# Altium schematic sheet STM32F429_MAIN.SchDoc
size A1; SheetNumber: 1; SheetTotal: 1
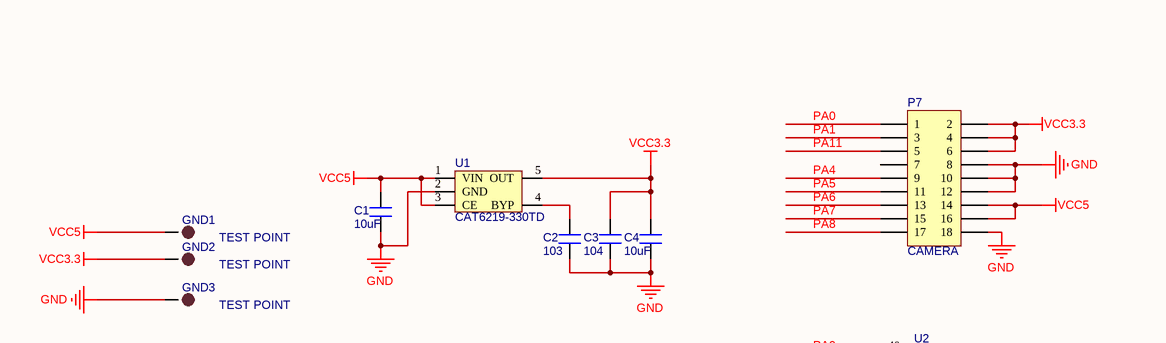
[diagram p0: STM32F429_MAIN.SchDoc, top left]
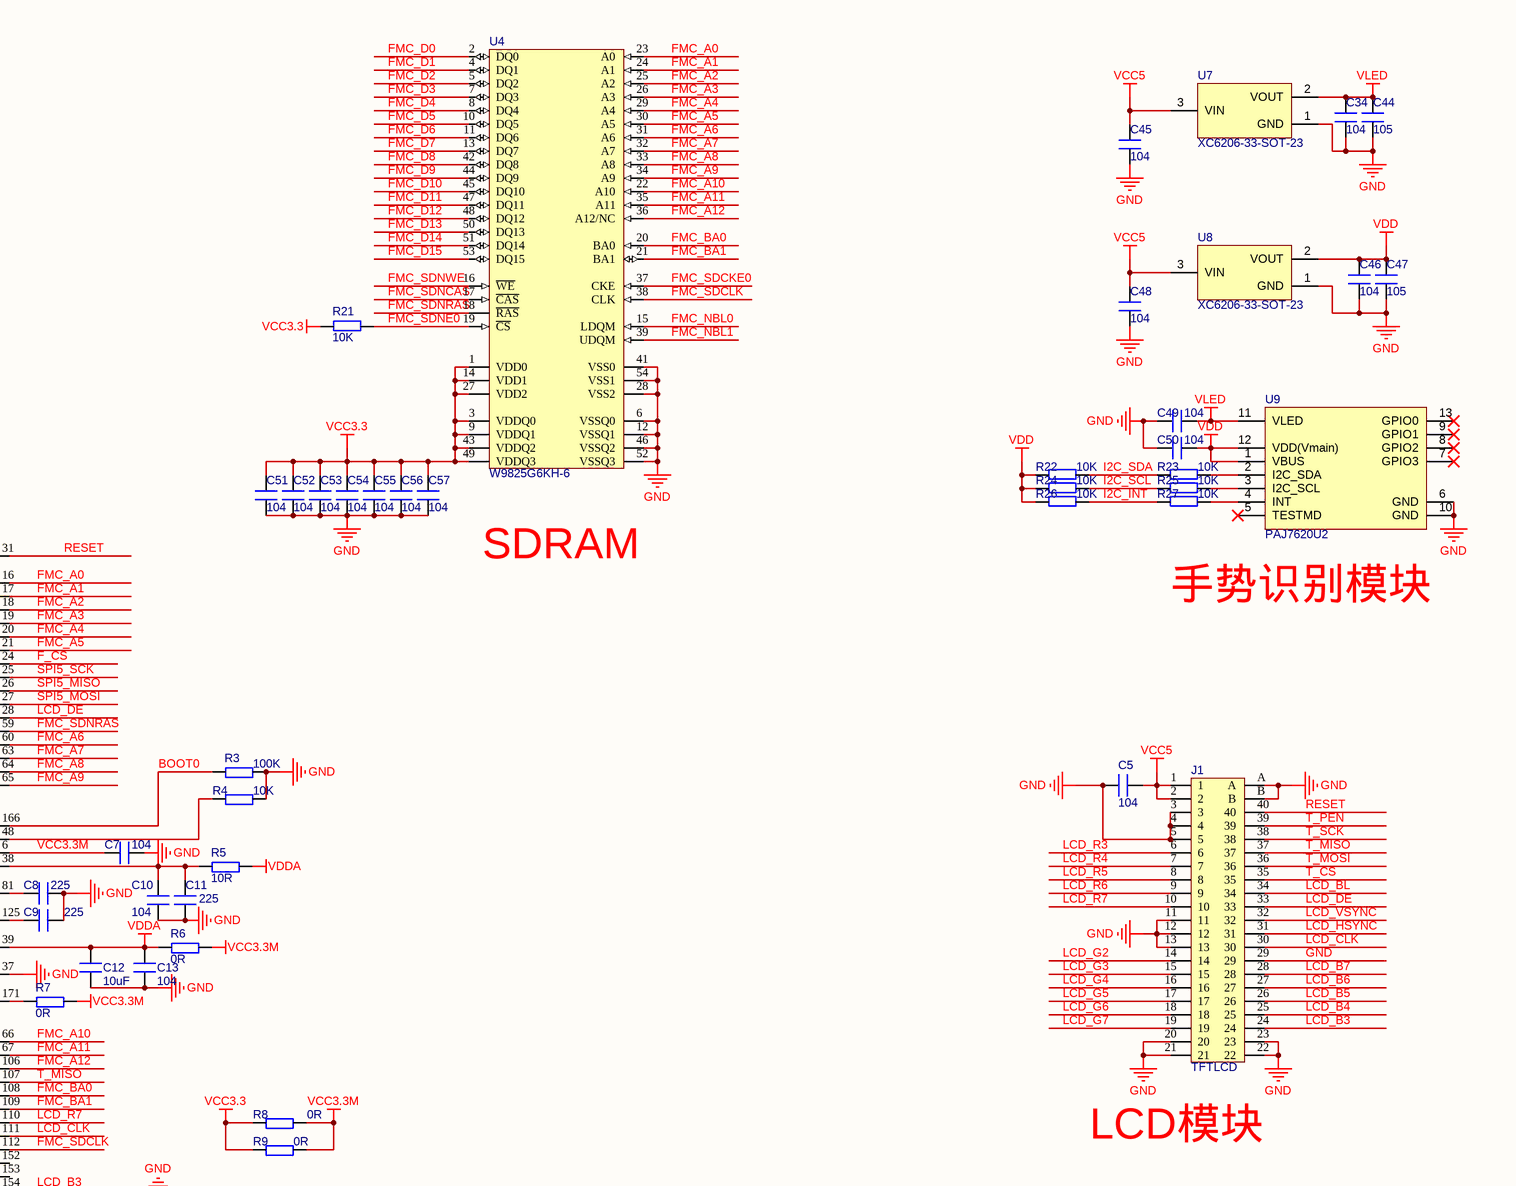
[diagram p1: STM32F429_MAIN.SchDoc, top right]
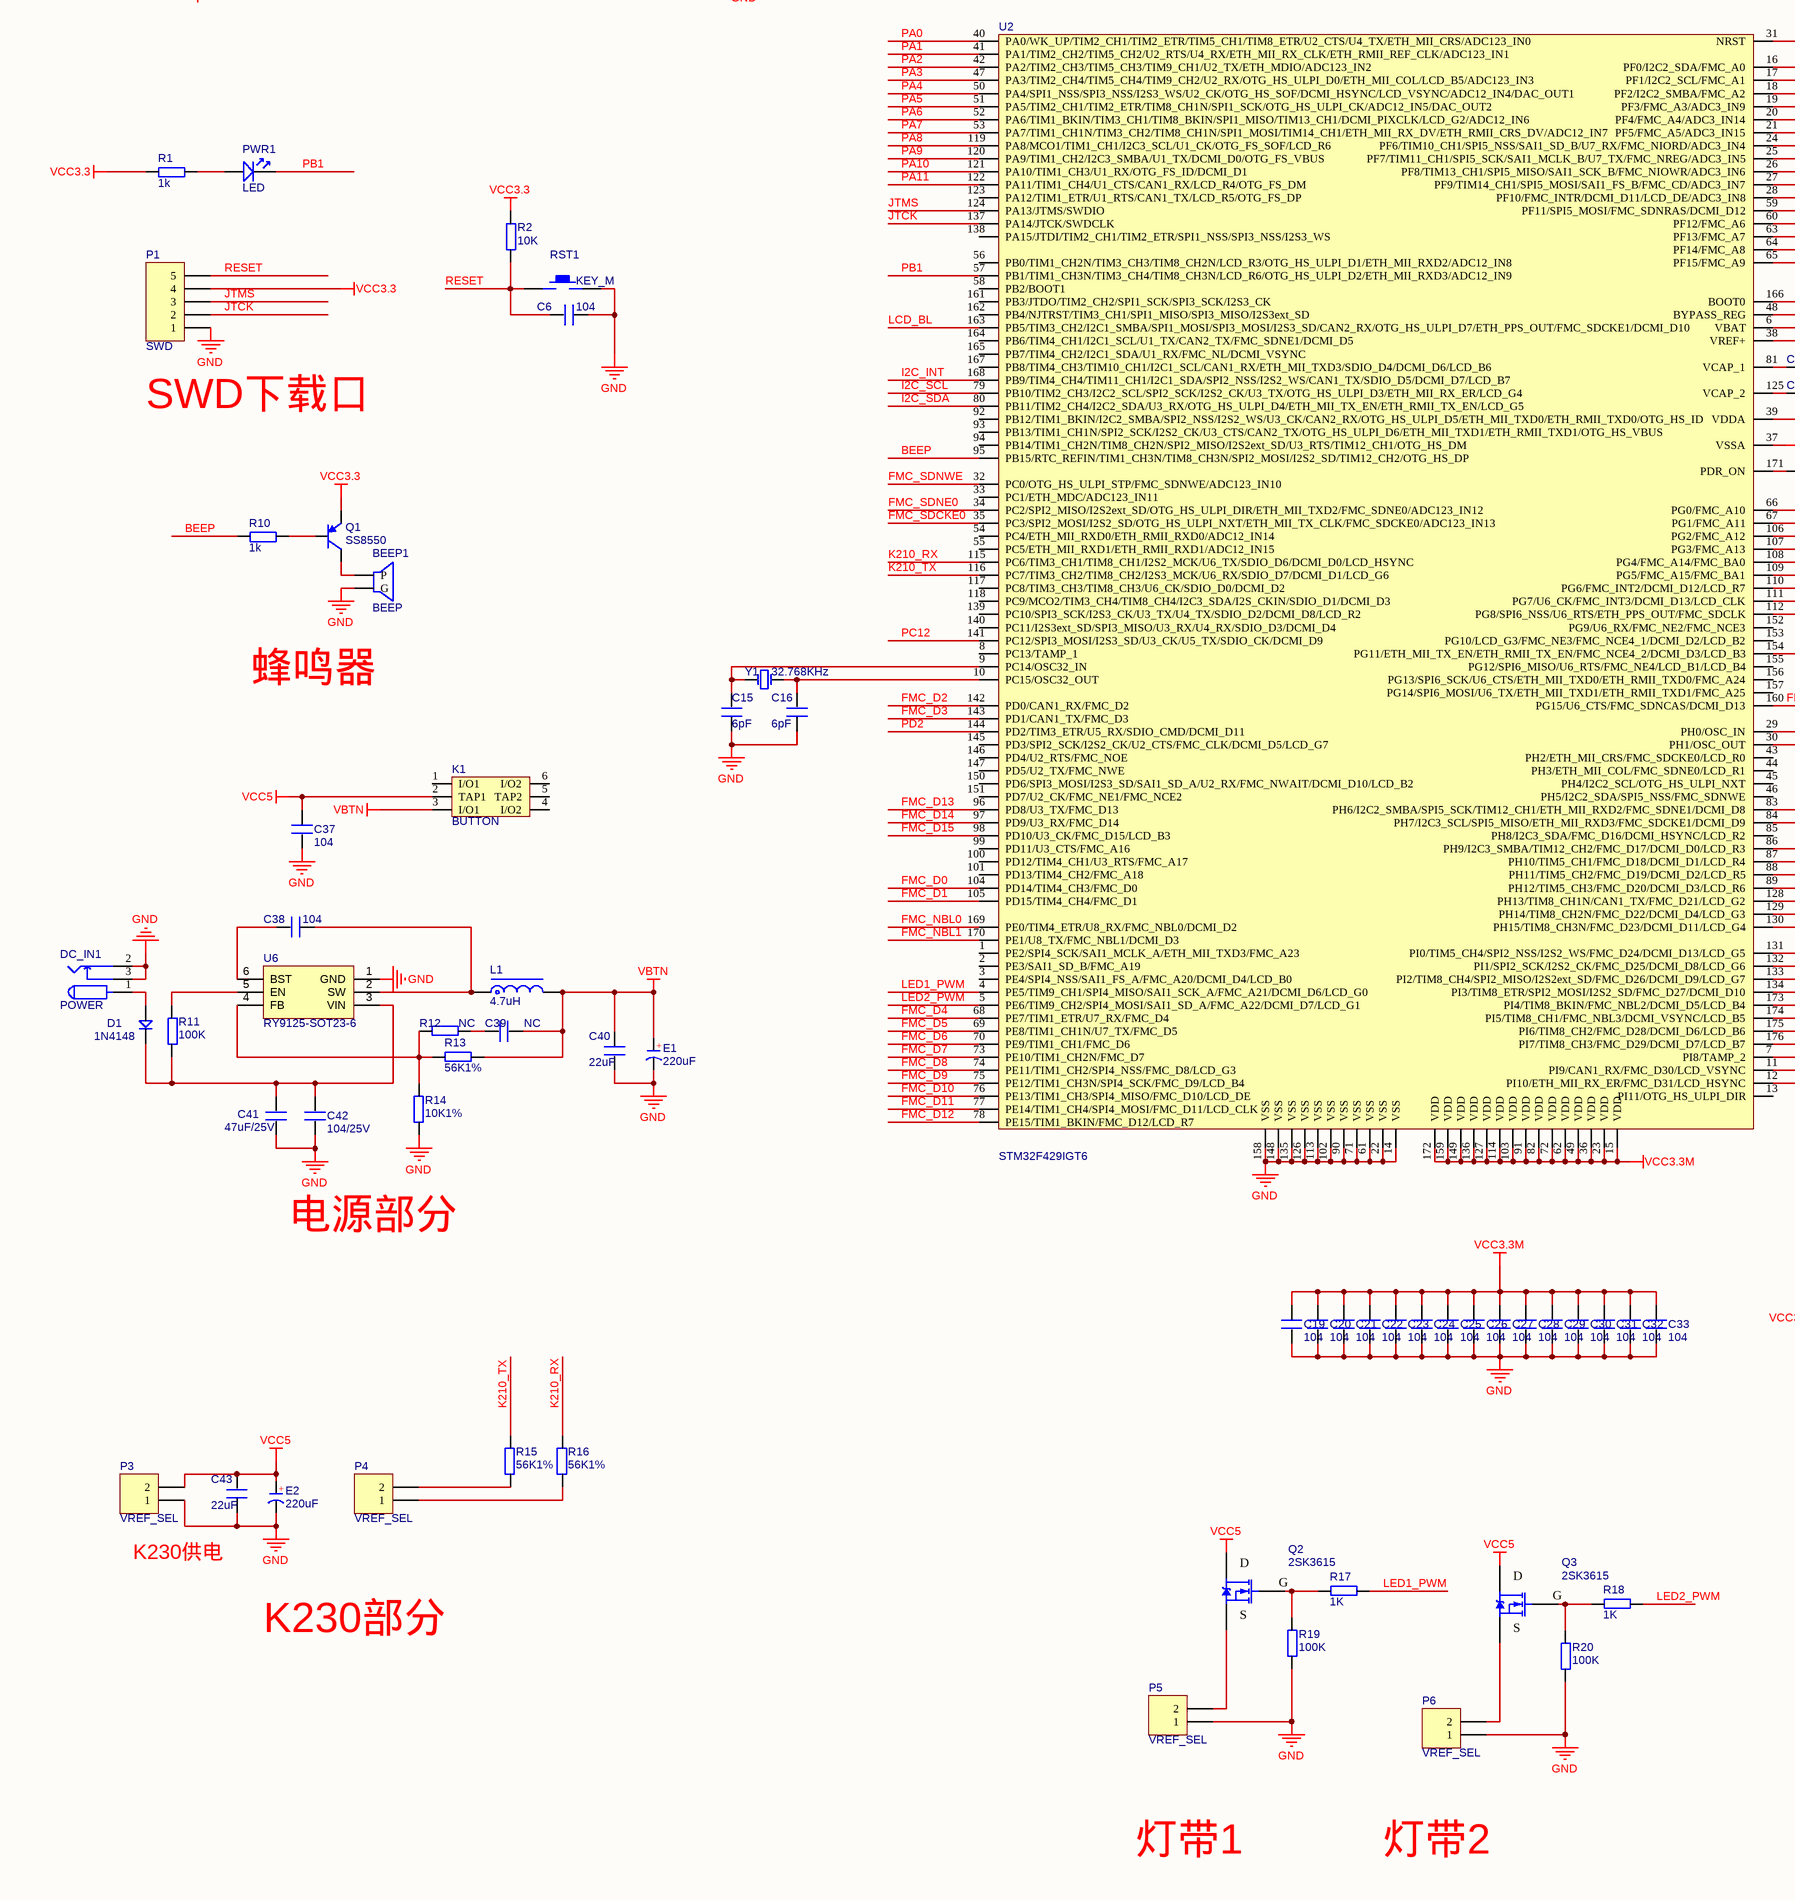
[diagram p2: STM32F429_MAIN.SchDoc, bottom left]
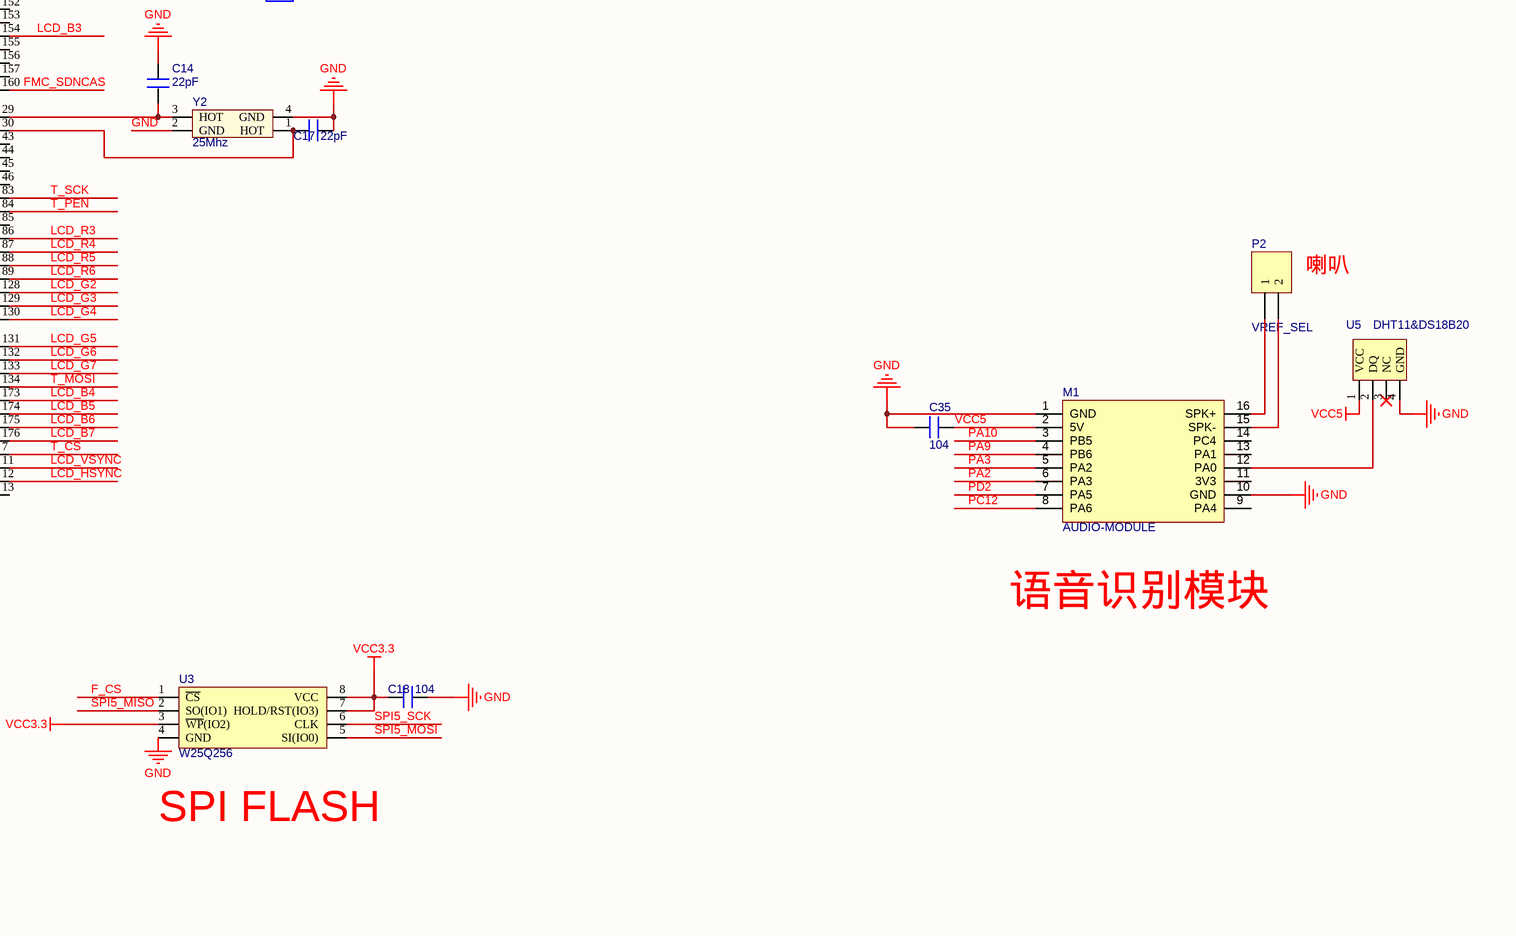
[diagram p3: STM32F429_MAIN.SchDoc, bottom right]

## Parts
BEEP1  BEEP  [BELL-5]
C1  10uF  [0402]
C2  103  [0402]
C3  104  [0402]
C4  10uF  [0402]
C5  104  [0603P]
C6  104  [0402]
C7  104  [0402]
C8  225  [0402]
C9  225  [0402]
C10  104  [0402]
C11  225  [0402]
C12  10uF  [0402]
C13  104  [0402]
C14  22pF  [0402]
C15  6pF  [0402]
C16  6pF  [0402]
C17  22pF  [0402]
C18  104  [0402]
C19  104  [0402]
C20  104  [0402]
C21  104  [0402]
C22  104  [0402]
C23  104  [0402]
C24  104  [0402]
C25  104  [0402]
C26  104  [0402]
C27  104  [0402]
C28  104  [0402]
C29  104  [0402]
C30  104  [0402]
C31  104  [0402]
C32  104  [0402]
C33  104  [0402]
C34  104  [0603P]
C35  104  [0603P]
C37  104  [0402]
C38  104  [0805]
C39  NC  [0603P]
C40  22uF  [C 1206_L]
C41  47uF/25V  [0805]
C42  104/25V  [0805]
C43  22uF  [0402]
C44  105  [0603P]
C45  104  [0603P]
C46  104  [0603P]
C47  105  [0603P]
C48  104  [0603P]
C49  104  [0603P]
C50  104  [0603P]
C51  104  [0603P]
C52  104  [0603P]
C53  104  [0603P]
C54  104  [0603P]
C55  104  [0603P]
C56  104  [0603P]
C57  104  [0603P]
D1  1N4148  [DIODE_SOP]
DC_IN1  POWER  [DC10B]
E1  220uF  [CM A(3*5.4)]
E2  220uF  [CM A(3*5.4)]
GND1  TEST POINT  [TP-1.5]
GND2  TEST POINT  [TP-1.5]
GND3  TEST POINT  [TP-1.5]
J1  TFTLCD  [FPC-TOP40]
K1  BUTTON  [BTN8.5*8.5]
L1  4.7uH  [CD31]
M1  AUDIO-MODULE  [AI_audio]
P1  SWD  [HDR1X5]
P2  VREF_SEL  [HDR1X2]
P3  VREF_SEL  [HDR1X2]
P4  VREF_SEL  [HDR1X2]
P5  VREF_SEL  [HDR1X2]
P6  VREF_SEL  [HDR1X2]
P7  CAMERA  [HDR2X9]
PWR1  LED  [SMDLED-0603]
Q1  SS8550  [SOT23-3N]
Q2  2SK3615  [TO252]
Q3  2SK3615  [TO252]
R1  1k  [0402]
R2  10K  [0402]
R3  100K  [0402]
R4  10K  [0402]
R5  10R  [0402]
R6  0R  [0402]
R7  0R  [0402]
R8  0R  [0402]
R9  0R  [0402]
R10  1k  [0402]
R11  100K  [0603P]
R12  NC  [0603P]
R13  56K1%  [0603P]
R14  10K1%  [0603P]
R15  56K1%  [0402]
R16  56K1%  [0402]
R17  1K  [0603P]
R18  1K  [0603P]
R19  100K  [0603P]
R20  100K  [0603P]
R21  10K  [0402]
R22  10K  [0402]
R23  10K  [0402]
R24  10K  [0402]
R25  10K  [0402]
R26  10K  [0402]
R27  10K  [0402]
RST1  KEY_M  [KEY_SOP3625]
U1  CAT6219-330TD  [SOT-23-5]
U2  STM32F429IGT6  [LQFP176]
U3  W25Q256  [WSON8]
U4  W9825G6KH-6  [TSOP54]
U5  DHT11&DS18B20  [DHT11]
U6  RY9125-SOT23-6  [SOT23-6]
U7  XC6206-33-SOT-23  [SOT-23]
U8  XC6206-33-SOT-23  [SOT-23]
U9  PAJ7620U2  [PAJ7620U2]
Y1  32.768KHz  [XTAL3215]
Y2  25Mhz  [XTAL3225]

## Nets
GND: BEEP1.2(G) C1.1 C2.1 C3.1 C4.1 C5.1 C6.1 C7.1 C8.1 C9.1 C10.1 C11.2 C12.1 C13.1 C14.2 C15.1 C16.1 C17.2 C18.1 C19.2 C20.2 C21.2 C22.2 C23.2 C24.2 C25.2 C26.2 C27.2 C28.2 C29.2 C30.2 C31.2 C32.2 C33.2 C34.1 C35.2 C37.1 C40.2 C41.2 C42.2 C43.2 C44.1 C45.1 C46.1 C47.1 C48.1 C49.1 C50.1 C51.1 C52.1 C53.1 C54.1 C55.1 C56.1 C57.1 DC_IN1.2 DC_IN1.3 E1.2(K) E2.2(K) GND3.1 J1.3 J1.4 J1.5 J1.11 J1.12 J1.13 J1.20 J1.21 J1.22 J1.23 J1.29 J1.A J1.B M1.1(GND) M1.10(GND) P1.1 P3.1 P5.1 P6.1 P7.8 P7.10 P7.12 P7.18 R3.2 R4.2 R14.2 R19.1 R20.1 RST1.2 U1.2(GND) U2.14(VSS) U2.22(VSS) U2.37(VSSA) U2.61(VSS) U2.71(VSS) U2.90(VSS) U2.102(VSS) U2.113(VSS) U2.126(VSS) U2.135(VSS) U2.148(VSS) U2.158(VSS) U3.4(GND) U4.6(VSSQ0) U4.12(VSSQ1) U4.28(VSS2) U4.41(VSS0) U4.46(VSSQ2) U4.52(VSSQ3) U4.54(VSS1) U5.4(GND) U6.1(GND) U7.1(GND) U8.1(GND) U9.6(GND) U9.10(GND) Y2.2(GND) Y2.4(GND)
VBTN: C39.1 C40.1 E1.1(A) K1.3(I/O1) L1.2 R13.1
VCC3.3: C3.2 C4.2 C18.2 C51.2 C52.2 C53.2 C54.2 C55.2 C56.2 C57.2 GND2.1 P1.4 P7.2 P7.4 P7.6 Q1.2(E) R1.1 R2.2 R8.1 R9.1 R21.2 U1.5(OUT) U3.3(~{WP}(IO2)) U3.7(HOLD/RST(IO3)) U3.8(VCC) U4.1(VDD0) U4.3(VDDQ0) U4.9(VDDQ1) U4.14(VDD1) U4.27(VDD2) U4.43(VDDQ2) U4.49(VDDQ3)
VCC3.3M: C7.2 C19.1 C20.1 C21.1 C22.1 C23.1 C24.1 C25.1 C26.1 C27.1 C28.1 C29.1 C30.1 C31.1 C32.1 C33.1 R6.2 R7.2 R8.2 R9.2 U2.6(VBAT) U2.15(VDD) U2.23(VDD) U2.36(VDD) U2.49(VDD) U2.62(VDD) U2.72(VDD) U2.82(VDD) U2.91(VDD) U2.103(VDD) U2.114(VDD) U2.127(VDD) U2.136(VDD) U2.149(VDD) U2.159(VDD) U2.172(VDD)
VCC5: C1.2 C5.2 C35.1 C37.2 C43.1 C45.2 C48.2 E2.1(A) GND1.1 J1.1 J1.2 K1.2(TAP1) M1.2(5V) P3.2 P7.14 P7.16 Q2.2(D) Q3.2(D) U1.1(VIN) U1.3(CE) U5.1(VCC) U7.3(VIN) U8.3(VIN)
VDD: C46.2 C47.2 C50.2 R22.2 R24.2 R26.2 U8.2(VOUT) U9.1(VBUS) U9.12(VDD(Vmain))
VDDA: C12.2 C13.2 R5.2 R6.1 U2.39(VDDA)
VLED: C34.2 C44.2 C49.2 U7.2(VOUT) U9.11(VLED)
BEEP: R10.1 U2.95(PB15/RTC_REFIN/TIM1_CH3N/TIM8_CH3N/SPI2_MOSI/I2S2_SD/TIM12_CH2/OTG_HS_DP)
BOOT0: R3.1 U2.166(BOOT0)
F_CS: U2.24(PF6/TIM10_CH1/SPI5_NSS/SAI1_SD_B/U7_RX/FMC_NIORD/ADC3_IN4) U3.1(~{CS})
FMC_A0: U2.16(PF0/I2C2_SDA/FMC_A0) U4.23(A0)
FMC_A1: U2.17(PF1/I2C2_SCL/FMC_A1) U4.24(A1)
FMC_A2: U2.18(PF2/I2C2_SMBA/FMC_A2) U4.25(A2)
FMC_A3: U2.19(PF3/FMC_A3/ADC3_IN9) U4.26(A3)
FMC_A4: U2.20(PF4/FMC_A4/ADC3_IN14) U4.29(A4)
FMC_A5: U2.21(PF5/FMC_A5/ADC3_IN15) U4.30(A5)
FMC_A6: U2.60(PF12/FMC_A6) U4.31(A6)
FMC_A7: U2.63(PF13/FMC_A7) U4.32(A7)
FMC_A8: U2.64(PF14/FMC_A8) U4.33(A8)
FMC_A9: U2.65(PF15/FMC_A9) U4.34(A9)
FMC_A10: U2.66(PG0/FMC_A10) U4.22(A10)
FMC_A11: U2.67(PG1/FMC_A11) U4.35(A11)
FMC_A12: U2.106(PG2/FMC_A12) U4.36(A12/NC)
FMC_BA0: U2.108(PG4/FMC_A14/FMC_BA0) U4.20(BA0)
FMC_BA1: U2.109(PG5/FMC_A15/FMC_BA1) U4.21(BA1)
FMC_D0: U2.104(PD14/TIM4_CH3/FMC_D0) U4.2(DQ0)
FMC_D1: U2.105(PD15/TIM4_CH4/FMC_D1) U4.4(DQ1)
FMC_D2: U2.142(PD0/CAN1_RX/FMC_D2) U4.5(DQ2)
FMC_D3: U2.143(PD1/CAN1_TX/FMC_D3) U4.7(DQ3)
FMC_D4: U2.68(PE7/TIM1_ETR/U7_RX/FMC_D4) U4.8(DQ4)
FMC_D5: U2.69(PE8/TIM1_CH1N/U7_TX/FMC_D5) U4.10(DQ5)
FMC_D6: U2.70(PE9/TIM1_CH1/FMC_D6) U4.11(DQ6)
FMC_D7: U2.73(PE10/TIM1_CH2N/FMC_D7) U4.13(DQ7)
FMC_D8: U2.74(PE11/TIM1_CH2/SPI4_NSS/FMC_D8/LCD_G3) U4.42(DQ8)
FMC_D9: U2.75(PE12/TIM1_CH3N/SPI4_SCK/FMC_D9/LCD_B4) U4.44(DQ9)
FMC_D10: U2.76(PE13/TIM1_CH3/SPI4_MISO/FMC_D10/LCD_DE) U4.45(DQ10)
FMC_D11: U2.77(PE14/TIM1_CH4/SPI4_MOSI/FMC_D11/LCD_CLK) U4.47(DQ11)
FMC_D12: U2.78(PE15/TIM1_BKIN/FMC_D12/LCD_R7) U4.48(DQ12)
FMC_D13: U2.96(PD8/U3_TX/FMC_D13) U4.50(DQ13)
FMC_D14: U2.97(PD9/U3_RX/FMC_D14) U4.51(DQ14)
FMC_D15: U2.98(PD10/U3_CK/FMC_D15/LCD_B3) U4.53(DQ15)
FMC_NBL0: U2.169(PE0/TIM4_ETR/U8_RX/FMC_NBL0/DCMI_D2) U4.15(LDQM)
FMC_NBL1: U2.170(PE1/U8_TX/FMC_NBL1/DCMI_D3) U4.39(UDQM)
FMC_SDCKE0: U2.35(PC3/SPI2_MOSI/I2S2_SD/OTG_HS_ULPI_NXT/ETH_MII_TX_CLK/FMC_SDCKE0/ADC123_IN13) U4.37(CKE)
FMC_SDCLK: U2.112(PG8/SPI6_NSS/U6_RTS/ETH_PPS_OUT/FMC_SDCLK) U4.38(CLK)
FMC_SDNCAS: U2.160(PG15/U6_CTS/FMC_SDNCAS/DCMI_D13) U4.17(~{CAS})
FMC_SDNE0: R21.1 U2.34(PC2/SPI2_MISO/I2S2ext_SD/OTG_HS_ULPI_DIR/ETH_MII_TXD2/FMC_SDNE0/ADC123_IN12) U4.19(~{CS})
FMC_SDNRAS: U2.59(PF11/SPI5_MOSI/FMC_SDNRAS/DCMI_D12) U4.18(~{RAS})
FMC_SDNWE: U2.32(PC0/OTG_HS_ULPI_STP/FMC_SDNWE/ADC123_IN10) U4.16(~{WE})
I2C_INT: R26.1 R27.2 U2.168(PB9/TIM4_CH4/TIM11_CH1/I2C1_SDA/SPI2_NSS/I2S2_WS/CAN1_TX/SDIO_D5/DCMI_D7/LCD_B7)
I2C_SCL: R24.1 R25.2 U2.79(PB10/TIM2_CH3/I2C2_SCL/SPI2_SCK/I2S2_CK/U3_TX/OTG_HS_ULPI_D3/ETH_MII_RX_ER/LCD_G4)
I2C_SDA: R22.1 R23.2 U2.80(PB11/TIM2_CH4/I2C2_SDA/U3_RX/OTG_HS_ULPI_D4/ETH_MII_TX_EN/ETH_RMII_TX_EN/LCD_G5)
JTCK: P1.2 U2.137(PA14/JTCK/SWDCLK)
JTMS: P1.3 U2.124(PA13/JTMS/SWDIO)
K210_RX: R16.1 U2.115(PC6/TIM3_CH1/TIM8_CH1/I2S2_MCK/U6_TX/SDIO_D6/DCMI_D0/LCD_HSYNC)
K210_TX: R15.1 U2.116(PC7/TIM3_CH2/TIM8_CH2/I2S3_MCK/U6_RX/SDIO_D7/DCMI_D1/LCD_G6)
LCD_B3: J1.24 U2.154(PG11/ETH_MII_TX_EN/ETH_RMII_TX_EN/FMC_NCE4_2/DCMI_D3/LCD_B3)
LCD_B4: J1.25 U2.173(PI4/TIM8_BKIN/FMC_NBL2/DCMI_D5/LCD_B4)
LCD_B5: J1.26 U2.174(PI5/TIM8_CH1/FMC_NBL3/DCMI_VSYNC/LCD_B5)
LCD_B6: J1.27 U2.175(PI6/TIM8_CH2/FMC_D28/DCMI_D6/LCD_B6)
LCD_B7: J1.28 U2.176(PI7/TIM8_CH3/FMC_D29/DCMI_D7/LCD_B7)
LCD_BL: J1.34 U2.163(PB5/TIM3_CH2/I2C1_SMBA/SPI1_MOSI/SPI3_MOSI/I2S3_SD/CAN2_RX/OTG_HS_ULPI_D7/ETH_PPS_OUT/FMC_SDCKE1/DCMI_D10)
LCD_CLK: J1.30 U2.111(PG7/U6_CK/FMC_INT3/DCMI_D13/LCD_CLK)
LCD_DE: J1.33 U2.28(PF10/FMC_INTR/DCMI_D11/LCD_DE/ADC3_IN8)
LCD_G2: J1.14 U2.128(PH13/TIM8_CH1N/CAN1_TX/FMC_D21/LCD_G2)
LCD_G3: J1.15 U2.129(PH14/TIM8_CH2N/FMC_D22/DCMI_D4/LCD_G3)
LCD_G4: J1.16 U2.130(PH15/TIM8_CH3N/FMC_D23/DCMI_D11/LCD_G4)
LCD_G5: J1.17 U2.131(PI0/TIM5_CH4/SPI2_NSS/I2S2_WS/FMC_D24/DCMI_D13/LCD_G5)
LCD_G6: J1.18 U2.132(PI1/SPI2_SCK/I2S2_CK/FMC_D25/DCMI_D8/LCD_G6)
LCD_G7: J1.19 U2.133(PI2/TIM8_CH4/SPI2_MISO/I2S2ext_SD/FMC_D26/DCMI_D9/LCD_G7)
LCD_HSYNC: J1.31 U2.12(PI10/ETH_MII_RX_ER/FMC_D31/LCD_HSYNC)
LCD_R3: J1.6 U2.86(PH9/I2C3_SMBA/TIM12_CH2/FMC_D17/DCMI_D0/LCD_R3)
LCD_R4: J1.7 U2.87(PH10/TIM5_CH1/FMC_D18/DCMI_D1/LCD_R4)
LCD_R5: J1.8 U2.88(PH11/TIM5_CH2/FMC_D19/DCMI_D2/LCD_R5)
LCD_R6: J1.9 U2.89(PH12/TIM5_CH3/FMC_D20/DCMI_D3/LCD_R6)
LCD_R7: J1.10 U2.110(PG6/FMC_INT2/DCMI_D12/LCD_R7)
LCD_VSYNC: J1.32 U2.11(PI9/CAN1_RX/FMC_D30/LCD_VSYNC)
LED1_PWM: R17.1 U2.4(PE5/TIM9_CH1/SPI4_MISO/SAI1_SCK_A/FMC_A21/DCMI_D6/LCD_G0)
LED2_PWM: R18.1 U2.5(PE6/TIM9_CH2/SPI4_MOSI/SAI1_SD_A/FMC_A22/DCMI_D7/LCD_G1)
PA0: P7.1 U2.40(PA0/WK_UP/TIM2_CH1/TIM2_ETR/TIM5_CH1/TIM8_ETR/U2_CTS/U4_TX/ETH_MII_CRS/ADC123_IN0)
PA1: P7.3 U2.41(PA1/TIM2_CH2/TIM5_CH2/U2_RTS/U4_RX/ETH_MII_RX_CLK/ETH_RMII_REF_CLK/ADC123_IN1)
PA2: M1.6(PA3) U2.42(PA2/TIM2_CH3/TIM5_CH3/TIM9_CH1/U2_TX/ETH_MDIO/ADC123_IN2)
PA3: M1.5(PA2) U2.47(PA3/TIM2_CH4/TIM5_CH4/TIM9_CH2/U2_RX/OTG_HS_ULPI_D0/ETH_MII_COL/LCD_B5/ADC123_IN3)
PA4: P7.9 U2.50(PA4/SPI1_NSS/SPI3_NSS/I2S3_WS/U2_CK/OTG_HS_SOF/DCMI_HSYNC/LCD_VSYNC/ADC12_IN4/DAC_OUT1)
PA5: P7.11 U2.51(PA5/TIM2_CH1/TIM2_ETR/TIM8_CH1N/SPI1_SCK/OTG_HS_ULPI_CK/ADC12_IN5/DAC_OUT2)
PA6: P7.13 U2.52(PA6/TIM1_BKIN/TIM3_CH1/TIM8_BKIN/SPI1_MISO/TIM13_CH1/DCMI_PIXCLK/LCD_G2/ADC12_IN6)
PA7: P7.15 U2.53(PA7/TIM1_CH1N/TIM3_CH2/TIM8_CH1N/SPI1_MOSI/TIM14_CH1/ETH_MII_RX_DV/ETH_RMII_CRS_DV/ADC12_IN7)
PA8: P7.17 U2.119(PA8/MCO1/TIM1_CH1/I2C3_SCL/U1_CK/OTG_FS_SOF/LCD_R6)
PA9: M1.4(PB6) U2.120(PA9/TIM1_CH2/I2C3_SMBA/U1_TX/DCMI_D0/OTG_FS_VBUS)
PA10: M1.3(PB5) U2.121(PA10/TIM1_CH3/U1_RX/OTG_FS_ID/DCMI_D1)
PA11: P7.5 U2.122(PA11/TIM1_CH4/U1_CTS/CAN1_RX/LCD_R4/OTG_FS_DM)
PB1: PWR1.2 U2.57(PB1/TIM1_CH3N/TIM3_CH4/TIM8_CH3N/LCD_R6/OTG_HS_ULPI_D2/ETH_MII_RXD3/ADC12_IN9)
PC12: M1.8(PA6) U2.141(PC12/SPI3_MOSI/I2S3_SD/U3_CK/U5_TX/SDIO_CK/DCMI_D9)
PD2: M1.7(PA5) U2.144(PD2/TIM3_ETR/U5_RX/SDIO_CMD/DCMI_D11)
RESET: C6.2 J1.40 P1.5 R2.1 RST1.1 U2.31(NRST)
SPI5_MISO: U2.26(PF8/TIM13_CH1/SPI5_MISO/SAI1_SCK_B/FMC_NIOWR/ADC3_IN6) U3.2(SO(IO1))
SPI5_MOSI: U2.27(PF9/TIM14_CH1/SPI5_MOSI/SAI1_FS_B/FMC_CD/ADC3_IN7) U3.5(SI(IO0))
SPI5_SCK: U2.25(PF7/TIM11_CH1/SPI5_SCK/SAI1_MCLK_B/U7_TX/FMC_NREG/ADC3_IN5) U3.6(CLK)
T_CS: J1.35 U2.7(PI8/TAMP_2)
T_MISO: J1.37 U2.107(PG3/FMC_A13)
T_MOSI: J1.36 U2.134(PI3/TIM8_ETR/SPI2_MOSI/I2S2_SD/FMC_D27/DCMI_D10)
T_PEN: J1.39 U2.84(PH7/I2C3_SCL/SPI5_MISO/ETH_MII_RXD3/FMC_SDCKE1/DCMI_D9)
T_SCK: J1.38 U2.83(PH6/I2C2_SMBA/SPI5_SCK/TIM12_CH1/ETH_MII_RXD2/FMC_SDNE1/DCMI_D8)
NetBEEP1_1: BEEP1.1(P) Q1.3(C)
NetC2_2: C2.2 U1.4(BYP)
NetC8_2: C8.2 U2.81(VCAP_1)
NetC9_2: C9.2 U2.125(VCAP_2)
NetC10_2: C10.2 C11.1 R5.1 U2.38(VREF+)
NetC14_1: C14.1 U2.29(PH0/OSC_IN) Y2.3(HOT)
NetC15_2: C15.2 U2.9(PC14/OSC32_IN) Y1.1(OSC1)
NetC16_2: C16.2 U2.10(PC15/OSC32_OUT) Y1.2(OSC2)
NetC17_1: C17.1 U2.30(PH1/OSC_OUT) Y2.1(HOT)
NetC38_1: C38.1 L1.1 U6.2(SW)
NetC38_2: C38.2 U6.6(BST)
NetC39_2: C39.2 R12.1
NetC41_1: C41.1 C42.1 D1.2 R11.1 U6.3(VIN)
NetD1_1: D1.1 DC_IN1.1
NetM1_12: M1.12(PA0) U5.2(DQ)
NetM1_15: M1.15(SPK-) P2.2
NetM1_16: M1.16(SPK+) P2.1
NetP4_1: P4.1 R16.2
NetP4_2: P4.2 R15.2
NetP5_2: P5.2 Q2.3(S)
NetP6_2: P6.2 Q3.3(S)
NetPWR1_1: PWR1.1 R1.2
NetQ1_1: Q1.1(B) R10.2
NetQ2_1: Q2.1(G) R17.2 R19.2
NetQ3_1: Q3.1(G) R18.2 R20.2
NetR4_1: R4.1 U2.48(BYPASS_REG)
NetR7_1: R7.1 U2.171(PDR_ON)
NetR11_2: R11.2 U6.5(EN)
NetR12_2: R12.2 R13.2 R14.1 U6.4(FB)
NetR23_1: R23.1 U9.2(I2C_SDA)
NetR25_1: R25.1 U9.3(I2C_SCL)
NetR27_1: R27.1 U9.4(INT)

Not connected (* = marked no-connect by the designer): K1 1(I/O1) 4(I/O2) 5(TAP2) 6(I/O2); M1 9(PA4) 11(3V3) 13(PA1) 14(PC4); P7 7; U2 1(PE2/SPI4_SCK/SAI1_MCLK_A/ETH_MII_TXD3/FMC_A23) 2(PE3/SAI1_SD_B/FMC_A19) 3(PE4/SPI4_NSS/SAI1_FS_A/FMC_A20/DCMI_D4/LCD_B0) 8(PC13/TAMP_1) 13(PI11/OTG_HS_ULPI_DIR) 33(PC1/ETH_MDC/ADC123_IN11) 43(PH2/ETH_MII_CRS/FMC_SDCKE0/LCD_R0) 44(PH3/ETH_MII_COL/FMC_SDNE0/LCD_R1) 45(PH4/I2C2_SCL/OTG_HS_ULPI_NXT) 46(PH5/I2C2_SDA/SPI5_NSS/FMC_SDNWE) 54(PC4/ETH_MII_RXD0/ETH_RMII_RXD0/ADC12_IN14) 55(PC5/ETH_MII_RXD1/ETH_RMII_RXD1/ADC12_IN15) 56(PB0/TIM1_CH2N/TIM3_CH3/TIM8_CH2N/LCD_R3/OTG_HS_ULPI_D1/ETH_MII_RXD2/ADC12_IN8) 58(PB2/BOOT1) 85(PH8/I2C3_SDA/FMC_D16/DCMI_HSYNC/LCD_R2) 92(PB12/TIM1_BKIN/I2C2_SMBA/SPI2_NSS/I2S2_WS/U3_CK/CAN2_RX/OTG_HS_ULPI_D5/ETH_MII_TXD0/ETH_RMII_TXD0/OTG_HS_ID) 93(PB13/TIM1_CH1N/SPI2_SCK/I2S2_CK/U3_CTS/CAN2_TX/OTG_HS_ULPI_D6/ETH_MII_TXD1/ETH_RMII_TXD1/OTG_HS_VBUS) 94(PB14/TIM1_CH2N/TIM8_CH2N/SPI2_MISO/I2S2ext_SD/U3_RTS/TIM12_CH1/OTG_HS_DM) 99(PD11/U3_CTS/FMC_A16) 100(PD12/TIM4_CH1/U3_RTS/FMC_A17) 101(PD13/TIM4_CH2/FMC_A18) 117(PC8/TIM3_CH3/TIM8_CH3/U6_CK/SDIO_D0/DCMI_D2) 118(PC9/MCO2/TIM3_CH4/TIM8_CH4/I2C3_SDA/I2S_CKIN/SDIO_D1/DCMI_D3) 123(PA12/TIM1_ETR/U1_RTS/CAN1_TX/LCD_R5/OTG_FS_DP) 138(PA15/JTDI/TIM2_CH1/TIM2_ETR/SPI1_NSS/SPI3_NSS/I2S3_WS) 139(PC10/SPI3_SCK/I2S3_CK/U3_TX/U4_TX/SDIO_D2/DCMI_D8/LCD_R2) 140(PC11/I2S3ext_SD/SPI3_MISO/U3_RX/U4_RX/SDIO_D3/DCMI_D4) 145(PD3/SPI2_SCK/I2S2_CK/U2_CTS/FMC_CLK/DCMI_D5/LCD_G7) 146(PD4/U2_RTS/FMC_NOE) 147(PD5/U2_TX/FMC_NWE) 150(PD6/SPI3_MOSI/I2S3_SD/SAI1_SD_A/U2_RX/FMC_NWAIT/DCMI_D10/LCD_B2) 151(PD7/U2_CK/FMC_NE1/FMC_NCE2) 152(PG9/U6_RX/FMC_NE2/FMC_NCE3) 153(PG10/LCD_G3/FMC_NE3/FMC_NCE4_1/DCMI_D2/LCD_B2) 155(PG12/SPI6_MISO/U6_RTS/FMC_NE4/LCD_B1/LCD_B4) 156(PG13/SPI6_SCK/U6_CTS/ETH_MII_TXD0/ETH_RMII_TXD0/FMC_A24) 157(PG14/SPI6_MOSI/U6_TX/ETH_MII_TXD1/ETH_RMII_TXD1/FMC_A25) 161(PB3/JTDO/TIM2_CH2/SPI1_SCK/SPI3_SCK/I2S3_CK) 162(PB4/NJTRST/TIM3_CH1/SPI1_MISO/SPI3_MISO/I2S3ext_SD) 164(PB6/TIM4_CH1/I2C1_SCL/U1_TX/CAN2_TX/FMC_SDNE1/DCMI_D5) 165(PB7/TIM4_CH2/I2C1_SDA/U1_RX/FMC_NL/DCMI_VSYNC) 167(PB8/TIM4_CH3/TIM10_CH1/I2C1_SCL/CAN1_RX/ETH_MII_TXD3/SDIO_D4/DCMI_D6/LCD_B6); U5 3(NC)*; U9 5(TESTMD)* 7(GPIO3)* 8(GPIO2)* 9(GPIO1)* 13(GPIO0)*

## Notes on the sheet
- SDRAM
- 手势识别模块
- (near P1) SWD下载口
- (near J1) LCD模块
- 蜂鸣器
- (near P2) 喇叭
- 语音识别模块
- 电源部分
- (near U3) SPI FLASH
- K230供电
- K230部分
- 灯带1
- 灯带2
- (in symbol C-CM) +

## Library data of the parts
C1-C35 C37-C57 = C
D1 = D
DC_IN1 = POW
E1 E2 = C-CM: 贴片电解电容; 版权归属: 源创客; BOM名称: 贴片电解电容; 学习资源: www.ooocke.com
GND1-GND3 = TEST-POINT: 测试点
J1 = FPC-40: FPC-40P-0.5mm
L1 = L-CD: 贴片功率电感; BOM名称: 功率电感; 版权归属: 源创客; 学习资源: www.ooocke.com
M1 = ai_audio
P1 = Header 5: Header, 5-Pin; LatestRevisionDate: 17-Jul-2002; LatestRevisionNote: Re-released for DXP Platform.; Publisher: Altium Limited
P2-P6 = Header 2: Header, 2-Pin; LatestRevisionDate: 17-Jul-2002; LatestRevisionNote: Re-released for DXP Platform.; Publisher: Altium Limited
P7 = Header 9X2: Header, 9-Pin, Dual row; LatestRevisionDate: 17-Jul-2002; LatestRevisionNote: Re-released for DXP Platform.; Publisher: Altium Limited
Q1 = 8550-SMD: 高频放大-PNP型; 版权归属: 源创客; 属性: 40V 1.5A 1W 100MHZ; BOM名称: 高频放大-PNP型; 学习资源: www.ooocke.com
Q2 Q3 = 2SK3615: N沟场效应管; 版权归属: 源创客; BOM名称: N沟场效应管; 学习资源: www.ooocke.com
R1-R27 = R
U1 = CAT6219-330TD: 3.3V 500mA LDO
U3 = W25Q128
U4 = IS42S16160B: 32MB SDRAM
U5 = DHT11: 数字温湿度传感器
U6 = RY9125
U7 U8 = XC6206-33
Y1 = XTAL: 普通晶振; Published: 8-Jun-2000; LatestRevisionDate: 17-Jul-2002; LatestRevisionNote: Re-released for DXP Platform.; Publisher: Altium Limited
Y2 = XTAL_3225: 3225贴片无源晶振